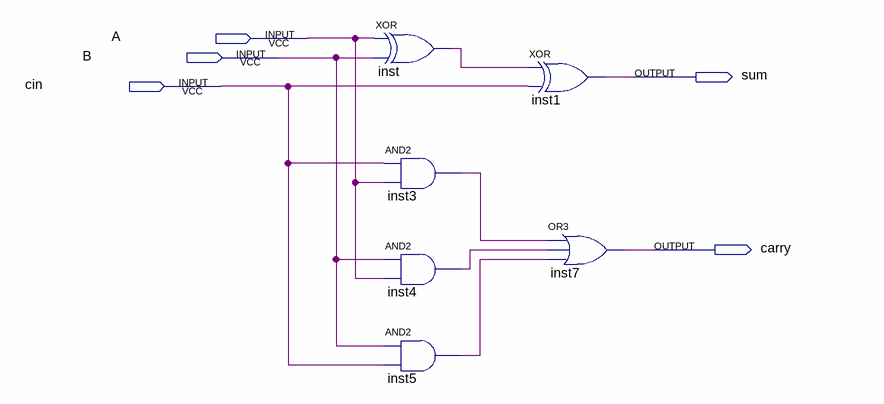
[diagram p0: schematic sheet]
// Quartus schematic adder.bdf as structural Verilog: 6 symbols, 5 pins
module adder (
  input  A,
  input  B,
  input  cin,
  output sum,
  output carry
);

  wire inst3_out, inst4_out, inst5_out, inst_out;

  xor inst (inst_out, A, B);
  and inst3 (inst3_out, cin, A);
  and inst4 (inst4_out, B, A);
  and inst5 (inst5_out, B, cin);
  xor inst1 (sum, inst_out, cin);
  or inst7 (carry, inst3_out, inst4_out, inst5_out);
endmodule
